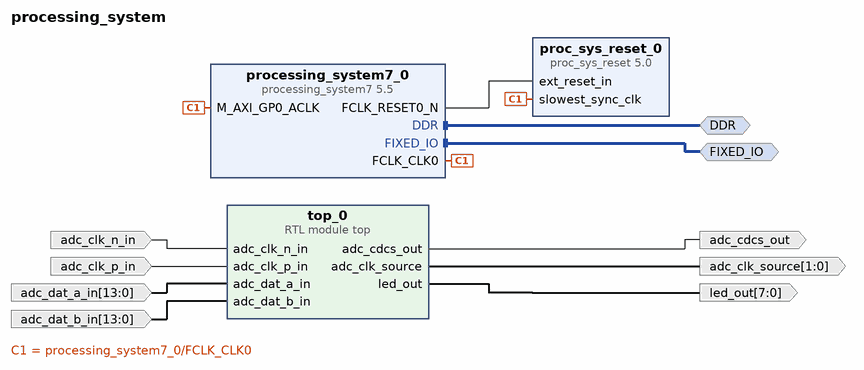
[diagram p0: block diagram of the top level]
# Vivado block design processing_system, xc7z010clg400-1, Vivado 2023.2
create_bd_design processing_system

create_bd_intf_port -mode Master -vlnv xilinx.com:display_processing_system7:fixedio_rtl:1.0 FIXED_IO
create_bd_intf_port -mode Master -vlnv xilinx.com:interface:ddrx_rtl:1.0 DDR
create_bd_port -dir I -type clk adc_clk_p_in
create_bd_port -dir I -type clk adc_clk_n_in
create_bd_port -dir I -from 13 -to 0 adc_dat_a_in
create_bd_port -dir I -from 13 -to 0 adc_dat_b_in
create_bd_port -dir O -from 1 -to 0 adc_clk_source
create_bd_port -dir O adc_cdcs_out
create_bd_port -dir O -from 7 -to 0 led_out

create_bd_cell -type ip -vlnv xilinx.com:ip:proc_sys_reset:5.0 proc_sys_reset_0
create_bd_cell -type ip -vlnv xilinx.com:ip:processing_system7:5.5 processing_system7_0
set_property -dict [list \
  CONFIG.PCW_UIPARAM_DDR_FREQ_MHZ 533.333333 \
  CONFIG.PCW_UIPARAM_DDR_MEMORY_TYPE {DDR 3 (Low Voltage)} \
  CONFIG.PCW_UIPARAM_DDR_PARTNO {MT41K256M16 RE-125} \
] [get_bd_cells processing_system7_0]
# 32 more settings of processing_system7_0 are not shown: defaults, MIO pin electricals, DDR timing, and values the tool derives
create_bd_cell -type module -reference top top_0

# ---- connections ----

connect_bd_intf_net [get_bd_intf_ports DDR] [get_bd_intf_pins processing_system7_0/DDR]
connect_bd_intf_net [get_bd_intf_ports FIXED_IO] [get_bd_intf_pins processing_system7_0/FIXED_IO]
connect_bd_net -net adc_clk_n_in_0_1 [get_bd_ports adc_clk_n_in] [get_bd_pins top_0/adc_clk_n_in]
connect_bd_net -net adc_clk_p_in_0_1 [get_bd_ports adc_clk_p_in] [get_bd_pins top_0/adc_clk_p_in]
connect_bd_net -net adc_dat_a_in_0_1 [get_bd_ports adc_dat_a_in] [get_bd_pins top_0/adc_dat_a_in]
connect_bd_net -net adc_dat_b_in_0_1 [get_bd_ports adc_dat_b_in] [get_bd_pins top_0/adc_dat_b_in]
connect_bd_net [get_bd_pins processing_system7_0/FCLK_CLK0] \
  [get_bd_pins proc_sys_reset_0/slowest_sync_clk] [get_bd_pins processing_system7_0/M_AXI_GP0_ACLK]
connect_bd_net [get_bd_pins processing_system7_0/FCLK_RESET0_N] [get_bd_pins proc_sys_reset_0/ext_reset_in]
connect_bd_net [get_bd_pins top_0/adc_cdcs_out] [get_bd_ports adc_cdcs_out]
connect_bd_net [get_bd_pins top_0/adc_clk_source] [get_bd_ports adc_clk_source]
connect_bd_net [get_bd_pins top_0/led_out] [get_bd_ports led_out]

validate_bd_design
save_bd_design
